# Altium schematic sheet B38_RF-RMT.SchDoc
size A
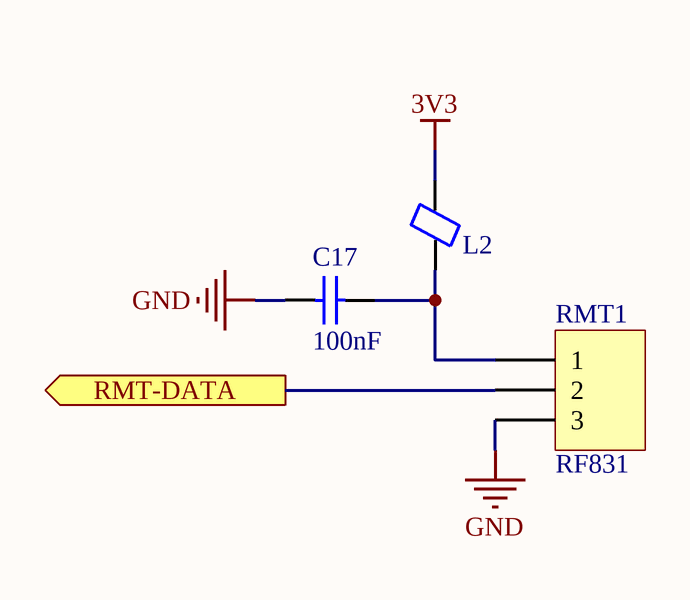
[diagram p0: B38_RF-RMT.SchDoc]

## Parts
C17  100nF  [CAP0603]
L2  Ferrite Bead SMD  [FB0603]  (value not drawn)
RMT1  RF831  [RF-RMT]

## Ports
RMT-DATA (out)

## Nets
3V3: L2.2
GND: C17.2 RMT1.3
RMT-DATA: RMT1.2 ; port RMT-DATA
NetC17_1: C17.1 L2.1 RMT1.1

## Library data of the parts
C17 = Cap: Capacitor 10V, 10%; Manufacturer: Walsin; PN: 0603B104K100CT; Value: 100nF
L2 = Ferrite Bead SMD Package: Ferrite Bead SMD, 100R; Designer: Ali Hafizi
RMT1 = Header 3: Header, 3-Pin; LatestRevisionDate: 17-Jul-2002; LatestRevisionNote: Re-released for DXP Platform.; Publisher: Altium Limited